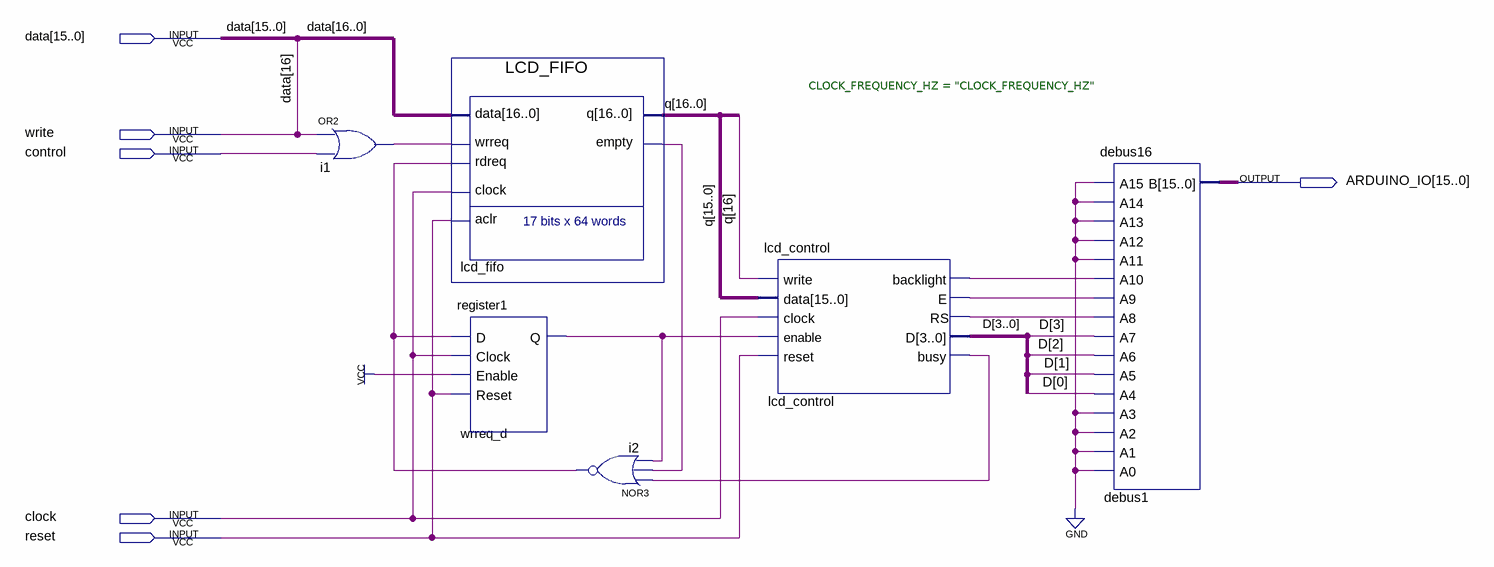
[diagram p0: schematic sheet]
// Quartus schematic arduino_shield.bdf as structural Verilog: 6 symbols, 6 pins
module arduino_shield (
  input  [15:0] data,
  input  write,
  input  control,
  input  clock,
  input  reset,
  output [15:0] ARDUINO_IO
);

  wire i1_out, i2_out, lcd_control_backlight, lcd_control_busy, lcd_control_e, lcd_control_rs,
       lcd_fifo_empty, wrreq_d_q;
  wire [3:0] D;
  wire [16:0] q;

  or i1 (i1_out, write, control);
  LCD_FIFO lcd_fifo (
    .data({write, data}), .wrreq(i1_out), .rdreq(i2_out), .clock(clock), .aclr(reset), .q(q),
    .empty(lcd_fifo_empty));
  register1 wrreq_d (.D(i2_out), .Clock(clock), .Enable(1'b1), .Reset(reset), .Q(wrreq_d_q));
  nor i2 (i2_out, lcd_control_busy, lcd_fifo_empty, wrreq_d_q);
  lcd_control #(.CLOCK_FREQUENCY_HZ("CLOCK_FREQUENCY_HZ")) lcd_control (
    .write(q[16]), .data(q[15:0]), .clock(clock), .enable(wrreq_d_q), .reset(reset),
    .backlight(lcd_control_backlight), .E(lcd_control_e), .RS(lcd_control_rs), .D(D), .busy(lcd_control_busy));
  debus16 debus1 (
    .A15(1'b0), .A14(1'b0), .A13(1'b0), .A12(1'b0), .A11(1'b0), .A10(lcd_control_backlight),
    .A9(lcd_control_e), .A8(lcd_control_rs), .A7(D[3]), .A6(D[2]), .A5(D[1]), .A4(D[0]), .A3(1'b0),
    .A2(1'b0), .A1(1'b0), .A0(1'b0), .B(ARDUINO_IO));

  // Other names for the same wires on the sheet: data[16] = write
endmodule
